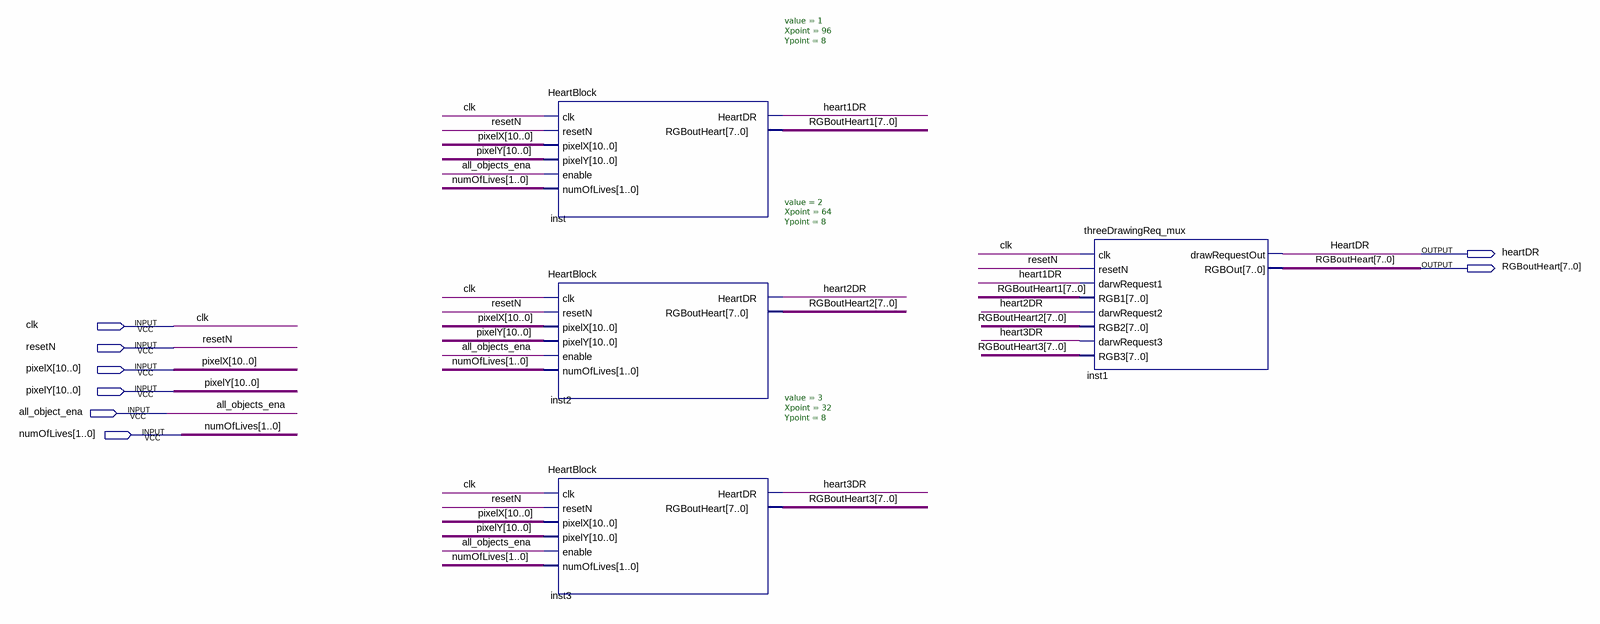
[diagram p0: schematic sheet]
// Quartus schematic HeartsBlock.bdf as structural Verilog: 4 symbols, 8 pins
module HeartsBlock (
  input  clk,
  input  resetN,
  input  [10:0] pixelX,
  input  [10:0] pixelY,
  input  all_object_ena,
  input  [1:0] numOfLives,
  output heartDR,
  output [7:0] RGBoutHeart
);

  wire heart1DR, heart2DR, heart3DR;
  wire [7:0] RGBoutHeart1, RGBoutHeart2, RGBoutHeart3;

  HeartBlock #(.value(1), .Xpoint(96), .Ypoint(8)) inst (
    .clk(clk), .resetN(resetN), .pixelX(pixelX), .pixelY(pixelY), .enable(all_object_ena),
    .numOfLives(numOfLives), .HeartDR(heart1DR), .RGBoutHeart(RGBoutHeart1));
  HeartBlock #(.value(2), .Xpoint(64), .Ypoint(8)) inst2 (
    .clk(clk), .resetN(resetN), .pixelX(pixelX), .pixelY(pixelY), .enable(all_object_ena),
    .numOfLives(numOfLives), .HeartDR(heart2DR), .RGBoutHeart(RGBoutHeart2));
  HeartBlock #(.value(3), .Xpoint(32), .Ypoint(8)) inst3 (
    .clk(clk), .resetN(resetN), .pixelX(pixelX), .pixelY(pixelY), .enable(all_object_ena),
    .numOfLives(numOfLives), .HeartDR(heart3DR), .RGBoutHeart(RGBoutHeart3));
  threeDrawingReq_mux inst1 (
    .clk(clk), .resetN(resetN), .darwRequest1(heart1DR), .RGB1(RGBoutHeart1), .darwRequest2(heart2DR),
    .RGB2(RGBoutHeart2), .darwRequest3(heart3DR), .RGB3(RGBoutHeart3), .drawRequestOut(heartDR),
    .RGBOut(RGBoutHeart));

  // Other names for the same wires on the sheet: all_objects_ena = all_object_ena
endmodule
